# EAGLE schematic board_V1_edit (EAGLE 9.3.0)
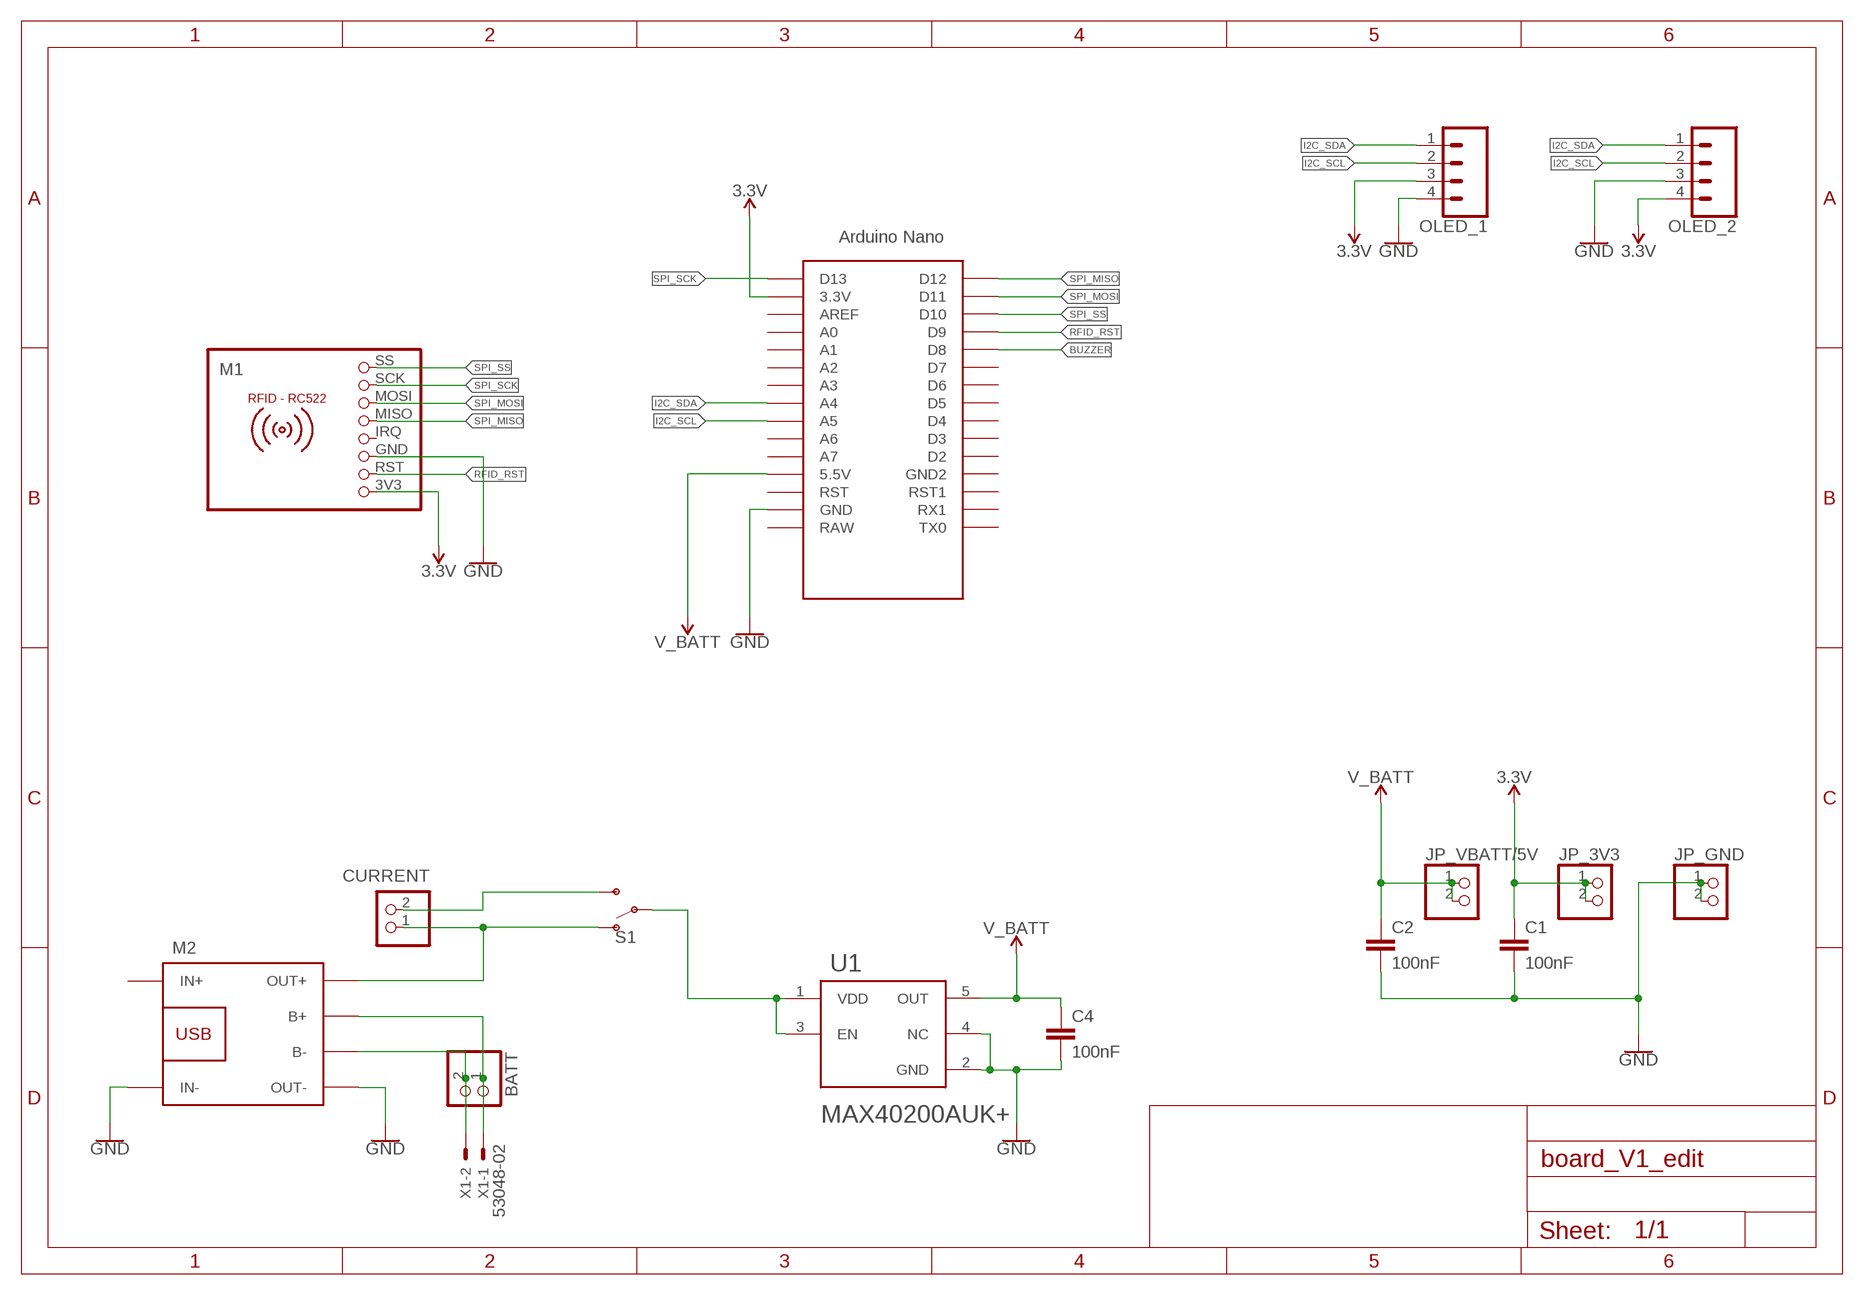
[diagram p0: schematic, sheet 1]

## Parts
BATT  PINHD-1X2  [1X02]
C1  100nF  C-EUC0805  [C0805]
C2  100nF  C-EUC0805  [C0805]
C4  100nF  C-EUC0805  [C0805]
CURRENT  PINHD-1X2  [1X02]
JP_3V3  PINHD-1X2  [1X02]
JP_GND  PINHD-1X2  [1X02]
JP_VBATT/5V  PINHD-1X2  [1X02]
M1  RFID-RC522  [RFID-RC522]
M2  BATTERY-CHARGER-LI-PROT  [BATTERY-CHARGER-LI-PROT]
OLED_1  CONN_04  [1X04]
OLED_2  CONN_04  [1X04]
S1  SWITCH-SPDT-PTH-11.6X4.0MM  [SWITCH_SPDT_PTH_11.6X4.0MM]
U1  MAXIM_ELECTRONICS_MAX40200AUK+MAXIM_ELECTRONICS_MAX40200AUK+_0_0  [MAXIM_ELECTRONICS_MAX40200AUK+_0]
U$1  NANO_ICSP-REMOVED  [NANO_ICSP-REMOVED]
X1  53048-02  [53048-02]

## Nets
3.3V [power]: C1.1 JP_3V3.1 JP_3V3.2 M1.3V3 OLED_1.3 OLED_2.4 U$1.3.3V
BATT_VOUT [power]: S1.2(P) U1.1(VDD) U1.3(EN)
BUZZER: U$1.D8
GND [power]: C1.2 C2.2 C4.2 JP_GND.1 JP_GND.2 M1.GND M2.IN- M2.OUT- OLED_1.4 OLED_2.3 U1.2(GND) U1.4(NC) U$1.GND
I2C_SCL: OLED_1.2 OLED_2.2 U$1.A5
I2C_SDA: OLED_1.1 OLED_2.1 U$1.A4
N$1 [power]: BATT.1 M2.B+ X1.1
N$2 [power]: CURRENT.1 M2.OUT+ S1.1(O)
N$4 [power]: CURRENT.2 S1.3(S)
N$5 [power]: BATT.2 M2.B- X1.2
RFID_RST: M1.RST U$1.D9
SPI_MISO: M1.MISO U$1.D12
SPI_MOSI: M1.MOSI U$1.D11
SPI_SCK: M1.SCK U$1.D13
SPI_SS: M1.SS U$1.D10
V_BATT [power]: C2.1 C4.1 JP_VBATT/5V.1 JP_VBATT/5V.2 U1.5(OUT) U$1.5V(5.5V)
Unconnected: M1.IRQ M2.IN+ U$1.A0 U$1.A1 U$1.A2 U$1.A3 U$1.A6 U$1.A7 U$1.AREF U$1.D2 U$1.D3 U$1.D4 U$1.D5 U$1.D6 U$1.D7 U$1.GND1(GND2) U$1.RAW U$1.RST U$1.RST1 U$1.RX1 U$1.TX0

## Library data of the parts
BATT CURRENT JP_3V3 JP_GND JP_VBATT/5V = pinhead:PINHD-1X2: PIN HEADER
C1 C2 C4 = rcl:C-EU: CAPACITOR, European symbol; SPICEPREFIX: C
M1 = mfrc522-module:RFID-RC522: RFID-RC522 MFRC-522 based breakout board
M2 = diy-modules:BATTERY-CHARGER-LI-PROT: Lithium Battery 5V Charger with protection circuit More details available here: http://www.instructables.com/id/DIY-Lithium-ion-Battery-Charger/step4/TP4056-based-lithium-ion-battery-charger-module/ Click here to find device on ebay.com <http://www.ebay.com/sch/tp4056+charger+usb+protection>
OLED_1 OLED_2 = SparkFun-Connectors:CONN_04: Multi connection point. Often used as Generic Header-pin footprint for 0.1 inch spaced/style header connections On any of the 0.1 inch spaced packages, you can populate with these: Break Away Headers - Straight <https://www.sparkfun.com/products/116> (PRT-00116) Break Away Male Headers - Right Angle <https://www.sparkfun.com/products/553> (PRT-00553) Female Headers <https://www.sparkfun.com/products/115> (PRT-00115) Break Away Headers - Machine Pin <https://www.sparkfun.com/products/117> (PRT-00117) Break Away Female Headers - Swiss Machine Pin <https://www.sparkfun.com/products/743> (PRT-00743) For SCREWTERMINALS and SPRING TERMINALS visit here: Screw Terimnals on SparkFun.com <https://www.sparkfun.com/search/results?term=Screw+Terminals> (5mm/3.5mm/2.54mm spacing) This device is also useful as a general connection point to wire up your design to another part of your project. Our various solder wires solder well into these plated through hole pads. Hook-Up Wire - Assortment (Stranded, 22 AWG) <https://www.sparkfun.com/products/11375> (PRT-11375) Hook-Up Wire - Assortment (Solid Core, 22 AWG) <https://www.sparkfun.com/products/11367> (PRT-11367) View the entire wire category on our website here <https://www.sparkfun.com/categories/141> Special notes: Molex polarized connector foot print use with SKU : PRT-08231 with associated crimp pins and housings. 1MM SMD Version SKU: PRT-10208; PROD_ID: CONN-09696
S1 = SparkFun-Switches:SWITCH-SPDT: Single Pole, Double Throw (SPDT) Switch Single-pole, double-throw (SPDT) switch. Variant Overview SMD-AYZ0202 Surface Mount DPDT Switch <https://www.sparkfun.com/products/597> (COM-00597) Used on e.g. LilyPad Arduino USB - ATmega32U4 Board <https://www.sparkfun.com/products/12049> PTH-11.6X4.0MM SPDT Mini Power Switch <https://www.sparkfun.com/products/102> (COM-00102) Used on e.g. SparkFun Simon Says - Through-Hole Soldering Kit <https://www.sparkfun.com/products/10547> (KIT-10547) PTH-11.6X4.0MM-KIT KIT version of SPDT Mini Power Switch - Simplifies soldering by removing tStop of switch pins - only one side can be soldered. PTH-11.6X4.0MM-LOCK LOCK version of SPDT Mini Power Switch - Offset pins hold switch in place for easier soldering. SMD-RIGHT-ANGLE Surface Mount Right Angle Switch <https://www.sparkfun.com/products/10860> (COM-10860) Used on e.g. SparkFun ESP8266 Thing <https://www.sparkfun.com/products/13231>; PROD_ID: SWCH-08261; SF_SKU: COM-00102
U1 = Maxim Electronics - MAX40200AUK+:MAXIM_ELECTRONICS_MAX40200AUK+: IDEAL DIODE CURRENT SW, 5.5V, SOT23-5; CENTROID_NOT_SPECIFIED: No; DATASHEET: https://datasheets.maximintegrated.com/en/ds/MAX40200.pdf; DEVICE_CLASS_L1: Integrated Circuits (ICs); DEVICE_CLASS_L2: Power Management ICs; DEVICE_CLASS_L3: unset; DIGIKEY_DESCRIPTION: IC DIODE CURRENT SWITCH SOT23-5; DIGIKEY_PART_NUMBER: MAX40200AUK+-ND; FOOTPRINT_URL: https://pdfserv.maximintegrated.com/land_patterns/90-0174.PDF; HEIGHT: 1.45mm; LEAD_FREE: yes; MAX_JUNCTION_TEMP: +150°C; MAX_POWER_DISSIPATION: 312.6mW; MAX_SUPPLY_VOLTAGE: 5.5V; MF: Maxim Electronics; MFG_PACKAGE_IDENT: U5-1; MFG_PACKAGE_IDENT_DATE: 0; MFG_PACKAGE_IDENT_REV: J; MIN_SUPPLY_VOLTAGE: 1.5V; MOUSER_PART_NUMBER: 700-MAX40200AUK+; MPN: MAX40200AUK+; NOMINAL_SUPPLY_CURRENT: 7uA; NUMBER_OF_OUTPUTS: 1; OUTPUT_CURRENT: 1A; PACKAGE: SOT23-5; PREFIX: U; ROHS: yes; STANDOFF_HEIGHT: 0mm; TEMPERATURE_RANGE_HIGH: +125°C; TEMPERATURE_RANGE_LOW: -40°C; VERIFICATION_VERSION: 0.0.0.1
U$1 = Arduino-clone:NANO_ICSP-REMOVED
X1 = con-molex:53?-02: CONNECTOR wire to board 1.25 mm (.049 inch) pitch header; MF: MOLEX; MPN: 53048-0210; OC_FARNELL: 1012259; OC_NEWARK: 57H4718

## Module BUZZER
Ports: 

### Library data of the parts

## Net classes
1 power: width 0.914 mm, clearance 0.254 mm